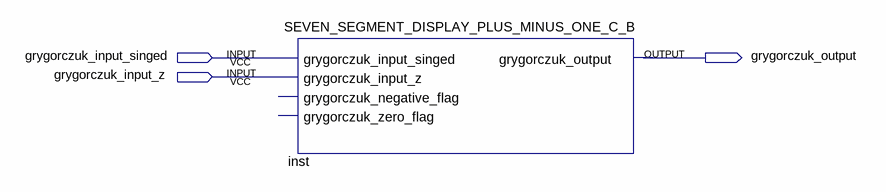
[diagram p0: schematic sheet]
// Quartus schematic SEVEN_SEGMENT_DISPLAY_PLUS_MINUS_ONE_C_B_SYMBOL.bdf as structural Verilog: 1 symbols, 3 pins
module SEVEN_SEGMENT_DISPLAY_PLUS_MINUS_ONE_C_B_SYMBOL (
  input  grygorczuk_input_singed,
  input  grygorczuk_input_z,
  output grygorczuk_output
);

  SEVEN_SEGMENT_DISPLAY_PLUS_MINUS_ONE_C_B inst (
    .grygorczuk_input_singed(grygorczuk_input_singed), .grygorczuk_input_z(grygorczuk_input_z));  // open: grygorczuk_negative_flag, grygorczuk_zero_flag, grygorczuk_output
endmodule
